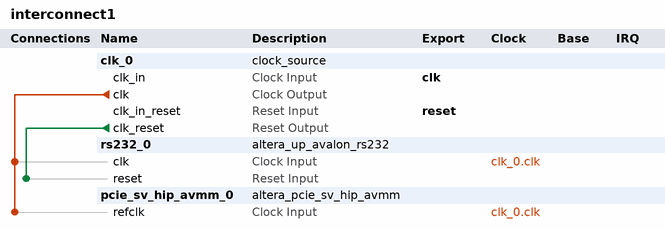
[diagram p0: system contents]
# Platform Designer (Qsys) system interconnect1, Stratix V 5SGXEABN3F45I3YY
# Parameters at their usual value, and those the tool derives, are not listed.
package require -exact qsys 23.1
create_system interconnect1
set_project_property DEVICE_FAMILY {Stratix V}
set_project_property DEVICE 5SGXEABN3F45I3YY

add_instance clk_0 clock_source 23.1
set_instance_parameter_value clk_0 clockFrequency 50000000

add_instance rs232_0 altera_up_avalon_rs232 17.1
set_instance_parameter_value rs232_0 baud 115200
set_instance_parameter_value rs232_0 parity None

add_instance pcie_sv_hip_avmm_0 altera_pcie_sv_hip_avmm 23.1
set_instance_parameter_value pcie_sv_hip_avmm_0 AST_LITE 0
set_instance_parameter_value pcie_sv_hip_avmm_0 AVALON_ADDR_WIDTH 32
set_instance_parameter_value pcie_sv_hip_avmm_0 AddressPage "0\\,1\\,2\\,3\\,4\\,5\\,6\\,7\\,8\\,9\\,10\\,11\\,12\\,13\\,14\\,15"
set_instance_parameter_value pcie_sv_hip_avmm_0 BYPASSS_A2P_TRANSLATION 0
set_instance_parameter_value pcie_sv_hip_avmm_0 CB_A2P_ADDR_MAP_FIXED_TABLE_0_HIGH 0
set_instance_parameter_value pcie_sv_hip_avmm_0 CB_A2P_ADDR_MAP_FIXED_TABLE_0_LOW 0
set_instance_parameter_value pcie_sv_hip_avmm_0 CB_A2P_ADDR_MAP_FIXED_TABLE_10_HIGH 0
set_instance_parameter_value pcie_sv_hip_avmm_0 CB_A2P_ADDR_MAP_FIXED_TABLE_10_LOW 0
set_instance_parameter_value pcie_sv_hip_avmm_0 CB_A2P_ADDR_MAP_FIXED_TABLE_11_HIGH 0
set_instance_parameter_value pcie_sv_hip_avmm_0 CB_A2P_ADDR_MAP_FIXED_TABLE_11_LOW 0
set_instance_parameter_value pcie_sv_hip_avmm_0 CB_A2P_ADDR_MAP_FIXED_TABLE_12_HIGH 0
set_instance_parameter_value pcie_sv_hip_avmm_0 CB_A2P_ADDR_MAP_FIXED_TABLE_12_LOW 0
set_instance_parameter_value pcie_sv_hip_avmm_0 CB_A2P_ADDR_MAP_FIXED_TABLE_13_HIGH 0
set_instance_parameter_value pcie_sv_hip_avmm_0 CB_A2P_ADDR_MAP_FIXED_TABLE_13_LOW 0
set_instance_parameter_value pcie_sv_hip_avmm_0 CB_A2P_ADDR_MAP_FIXED_TABLE_14_HIGH 0
set_instance_parameter_value pcie_sv_hip_avmm_0 CB_A2P_ADDR_MAP_FIXED_TABLE_14_LOW 0
set_instance_parameter_value pcie_sv_hip_avmm_0 CB_A2P_ADDR_MAP_FIXED_TABLE_15_HIGH 0
set_instance_parameter_value pcie_sv_hip_avmm_0 CB_A2P_ADDR_MAP_FIXED_TABLE_15_LOW 0
set_instance_parameter_value pcie_sv_hip_avmm_0 CB_A2P_ADDR_MAP_FIXED_TABLE_1_HIGH 0
set_instance_parameter_value pcie_sv_hip_avmm_0 CB_A2P_ADDR_MAP_FIXED_TABLE_1_LOW 0
set_instance_parameter_value pcie_sv_hip_avmm_0 CB_A2P_ADDR_MAP_FIXED_TABLE_2_HIGH 0
set_instance_parameter_value pcie_sv_hip_avmm_0 CB_A2P_ADDR_MAP_FIXED_TABLE_2_LOW 0
set_instance_parameter_value pcie_sv_hip_avmm_0 CB_A2P_ADDR_MAP_FIXED_TABLE_3_HIGH 0
set_instance_parameter_value pcie_sv_hip_avmm_0 CB_A2P_ADDR_MAP_FIXED_TABLE_3_LOW 0
set_instance_parameter_value pcie_sv_hip_avmm_0 CB_A2P_ADDR_MAP_FIXED_TABLE_4_HIGH 0
set_instance_parameter_value pcie_sv_hip_avmm_0 CB_A2P_ADDR_MAP_FIXED_TABLE_4_LOW 0
set_instance_parameter_value pcie_sv_hip_avmm_0 CB_A2P_ADDR_MAP_FIXED_TABLE_5_HIGH 0
set_instance_parameter_value pcie_sv_hip_avmm_0 CB_A2P_ADDR_MAP_FIXED_TABLE_5_LOW 0
set_instance_parameter_value pcie_sv_hip_avmm_0 CB_A2P_ADDR_MAP_FIXED_TABLE_6_HIGH 0
set_instance_parameter_value pcie_sv_hip_avmm_0 CB_A2P_ADDR_MAP_FIXED_TABLE_6_LOW 0
set_instance_parameter_value pcie_sv_hip_avmm_0 CB_A2P_ADDR_MAP_FIXED_TABLE_7_HIGH 0
set_instance_parameter_value pcie_sv_hip_avmm_0 CB_A2P_ADDR_MAP_FIXED_TABLE_7_LOW 0
set_instance_parameter_value pcie_sv_hip_avmm_0 CB_A2P_ADDR_MAP_FIXED_TABLE_8_HIGH 0
set_instance_parameter_value pcie_sv_hip_avmm_0 CB_A2P_ADDR_MAP_FIXED_TABLE_8_LOW 0
set_instance_parameter_value pcie_sv_hip_avmm_0 CB_A2P_ADDR_MAP_FIXED_TABLE_9_HIGH 0
set_instance_parameter_value pcie_sv_hip_avmm_0 CB_A2P_ADDR_MAP_FIXED_TABLE_9_LOW 0
set_instance_parameter_value pcie_sv_hip_avmm_0 CB_A2P_ADDR_MAP_IS_FIXED 0
set_instance_parameter_value pcie_sv_hip_avmm_0 CB_A2P_ADDR_MAP_NUM_ENTRIES 2
set_instance_parameter_value pcie_sv_hip_avmm_0 CB_A2P_ADDR_MAP_PASS_THRU_BITS 20
set_instance_parameter_value pcie_sv_hip_avmm_0 CB_P2A_AVALON_ADDR_B0 0x00000000
set_instance_parameter_value pcie_sv_hip_avmm_0 CB_P2A_AVALON_ADDR_B1 0x00000000
set_instance_parameter_value pcie_sv_hip_avmm_0 CB_P2A_AVALON_ADDR_B2 0x00000000
set_instance_parameter_value pcie_sv_hip_avmm_0 CB_P2A_AVALON_ADDR_B3 0x00000000
set_instance_parameter_value pcie_sv_hip_avmm_0 CB_P2A_AVALON_ADDR_B4 0x00000000
set_instance_parameter_value pcie_sv_hip_avmm_0 CB_P2A_AVALON_ADDR_B5 0x00000000
set_instance_parameter_value pcie_sv_hip_avmm_0 CB_P2A_FIXED_AVALON_ADDR_B0 0
set_instance_parameter_value pcie_sv_hip_avmm_0 CB_P2A_FIXED_AVALON_ADDR_B1 0
set_instance_parameter_value pcie_sv_hip_avmm_0 CB_P2A_FIXED_AVALON_ADDR_B2 0
set_instance_parameter_value pcie_sv_hip_avmm_0 CB_P2A_FIXED_AVALON_ADDR_B3 0
set_instance_parameter_value pcie_sv_hip_avmm_0 CB_P2A_FIXED_AVALON_ADDR_B4 0
set_instance_parameter_value pcie_sv_hip_avmm_0 CB_P2A_FIXED_AVALON_ADDR_B5 0
set_instance_parameter_value pcie_sv_hip_avmm_0 CB_PCIE_MODE 0
set_instance_parameter_value pcie_sv_hip_avmm_0 CB_PCIE_RX_LITE 0
set_instance_parameter_value pcie_sv_hip_avmm_0 CB_RP_S_ADDR_WIDTH 32
set_instance_parameter_value pcie_sv_hip_avmm_0 CG_COMMON_CLOCK_MODE 1
set_instance_parameter_value pcie_sv_hip_avmm_0 CG_ENABLE_A2P_INTERRUPT 0
set_instance_parameter_value pcie_sv_hip_avmm_0 CG_ENABLE_ADVANCED_INTERRUPT 0
set_instance_parameter_value pcie_sv_hip_avmm_0 CG_ENABLE_HIP_STATUS 0
set_instance_parameter_value pcie_sv_hip_avmm_0 CG_ENABLE_HIP_STATUS_EXTENSION 0
set_instance_parameter_value pcie_sv_hip_avmm_0 CG_IMPL_CRA_AV_SLAVE_PORT 1
set_instance_parameter_value pcie_sv_hip_avmm_0 CG_RXM_IRQ_NUM 16
set_instance_parameter_value pcie_sv_hip_avmm_0 NUM_PREFETCH_MASTERS 1
set_instance_parameter_value pcie_sv_hip_avmm_0 PCIeAddress31_0 "0x00000000\\,0x00000000\\,0x00000000\\,0x00000000\\,0x00000000\\,0x00000000\\,0x00000000\\,0x00000000\\,0x00000000\\,0x00000000\\,0x00000000\\,0x00000000\\,0x00000000\\,0x00000000\\,0x00000000\\,0x00000000"
set_instance_parameter_value pcie_sv_hip_avmm_0 PCIeAddress63_32 "0x00000000\\,0x00000000\\,0x00000000\\,0x00000000\\,0x00000000\\,0x00000000\\,0x00000000\\,0x00000000\\,0x00000000\\,0x00000000\\,0x00000000\\,0x00000000\\,0x00000000\\,0x00000000\\,0x00000000\\,0x00000000"
set_instance_parameter_value pcie_sv_hip_avmm_0 RXM_BEN_WIDTH 8
set_instance_parameter_value pcie_sv_hip_avmm_0 RXM_DATA_WIDTH 64
set_instance_parameter_value pcie_sv_hip_avmm_0 SLAVE_ADDRESS_MAP_0 0
set_instance_parameter_value pcie_sv_hip_avmm_0 SLAVE_ADDRESS_MAP_1 0
set_instance_parameter_value pcie_sv_hip_avmm_0 SLAVE_ADDRESS_MAP_2 0
set_instance_parameter_value pcie_sv_hip_avmm_0 SLAVE_ADDRESS_MAP_3 0
set_instance_parameter_value pcie_sv_hip_avmm_0 SLAVE_ADDRESS_MAP_4 0
set_instance_parameter_value pcie_sv_hip_avmm_0 SLAVE_ADDRESS_MAP_5 0
set_instance_parameter_value pcie_sv_hip_avmm_0 TX_S_ADDR_WIDTH 32
set_instance_parameter_value pcie_sv_hip_avmm_0 advanced_default_hwtcl_atomic_malformed true
set_instance_parameter_value pcie_sv_hip_avmm_0 advanced_default_hwtcl_atomic_op_completer_32bit false
set_instance_parameter_value pcie_sv_hip_avmm_0 advanced_default_hwtcl_atomic_op_completer_64bit false
set_instance_parameter_value pcie_sv_hip_avmm_0 advanced_default_hwtcl_atomic_op_routing false
set_instance_parameter_value pcie_sv_hip_avmm_0 advanced_default_hwtcl_bridge_port_ssid_support false
set_instance_parameter_value pcie_sv_hip_avmm_0 advanced_default_hwtcl_bridge_port_vga_enable false
set_instance_parameter_value pcie_sv_hip_avmm_0 advanced_default_hwtcl_bypass_cdc false
set_instance_parameter_value pcie_sv_hip_avmm_0 advanced_default_hwtcl_cas_completer_128bit false
set_instance_parameter_value pcie_sv_hip_avmm_0 advanced_default_hwtcl_cdc_dummy_insert_limit 11
set_instance_parameter_value pcie_sv_hip_avmm_0 advanced_default_hwtcl_d0_pme false
set_instance_parameter_value pcie_sv_hip_avmm_0 advanced_default_hwtcl_d1_pme false
set_instance_parameter_value pcie_sv_hip_avmm_0 advanced_default_hwtcl_d1_support false
set_instance_parameter_value pcie_sv_hip_avmm_0 advanced_default_hwtcl_d2_pme false
set_instance_parameter_value pcie_sv_hip_avmm_0 advanced_default_hwtcl_d2_support false
set_instance_parameter_value pcie_sv_hip_avmm_0 advanced_default_hwtcl_d3_cold_pme false
set_instance_parameter_value pcie_sv_hip_avmm_0 advanced_default_hwtcl_d3_hot_pme false
set_instance_parameter_value pcie_sv_hip_avmm_0 advanced_default_hwtcl_data_pack_rx disable
set_instance_parameter_value pcie_sv_hip_avmm_0 advanced_default_hwtcl_deskew_comma com_deskw
set_instance_parameter_value pcie_sv_hip_avmm_0 advanced_default_hwtcl_device_number 0
set_instance_parameter_value pcie_sv_hip_avmm_0 advanced_default_hwtcl_disable_link_x2_support false
set_instance_parameter_value pcie_sv_hip_avmm_0 advanced_default_hwtcl_disable_snoop_packet false
set_instance_parameter_value pcie_sv_hip_avmm_0 advanced_default_hwtcl_ei_delay_powerdown_count 10
set_instance_parameter_value pcie_sv_hip_avmm_0 advanced_default_hwtcl_eie_before_nfts_count 4
set_instance_parameter_value pcie_sv_hip_avmm_0 advanced_default_hwtcl_enable_adapter_half_rate_mode false
set_instance_parameter_value pcie_sv_hip_avmm_0 advanced_default_hwtcl_enable_l1_aspm false
set_instance_parameter_value pcie_sv_hip_avmm_0 advanced_default_hwtcl_enable_rx_buffer_checking false
set_instance_parameter_value pcie_sv_hip_avmm_0 advanced_default_hwtcl_extended_format_field false
set_instance_parameter_value pcie_sv_hip_avmm_0 advanced_default_hwtcl_extended_tag_reset false
set_instance_parameter_value pcie_sv_hip_avmm_0 advanced_default_hwtcl_fc_init_timer 1024
set_instance_parameter_value pcie_sv_hip_avmm_0 advanced_default_hwtcl_flow_control_timeout_count 200
set_instance_parameter_value pcie_sv_hip_avmm_0 advanced_default_hwtcl_flow_control_update_count 30
set_instance_parameter_value pcie_sv_hip_avmm_0 advanced_default_hwtcl_flr_capability false
set_instance_parameter_value pcie_sv_hip_avmm_0 advanced_default_hwtcl_gen2_diffclock_nfts_count 255
set_instance_parameter_value pcie_sv_hip_avmm_0 advanced_default_hwtcl_gen2_sameclock_nfts_count 255
set_instance_parameter_value pcie_sv_hip_avmm_0 advanced_default_hwtcl_hot_plug_support 0
set_instance_parameter_value pcie_sv_hip_avmm_0 advanced_default_hwtcl_interrupt_pin inta
set_instance_parameter_value pcie_sv_hip_avmm_0 advanced_default_hwtcl_l01_entry_latency 31
set_instance_parameter_value pcie_sv_hip_avmm_0 advanced_default_hwtcl_l0_exit_latency_diffclock 6
set_instance_parameter_value pcie_sv_hip_avmm_0 advanced_default_hwtcl_l0_exit_latency_sameclock 6
set_instance_parameter_value pcie_sv_hip_avmm_0 advanced_default_hwtcl_l1_exit_latency_diffclock 0
set_instance_parameter_value pcie_sv_hip_avmm_0 advanced_default_hwtcl_l1_exit_latency_sameclock 0
set_instance_parameter_value pcie_sv_hip_avmm_0 advanced_default_hwtcl_low_priority_vc single_vc
set_instance_parameter_value pcie_sv_hip_avmm_0 advanced_default_hwtcl_ltr_mechanism false
set_instance_parameter_value pcie_sv_hip_avmm_0 advanced_default_hwtcl_ltssm_1ms_timeout disable
set_instance_parameter_value pcie_sv_hip_avmm_0 advanced_default_hwtcl_ltssm_freqlocked_check disable
set_instance_parameter_value pcie_sv_hip_avmm_0 advanced_default_hwtcl_maximum_current 0
set_instance_parameter_value pcie_sv_hip_avmm_0 advanced_default_hwtcl_no_command_completed false
set_instance_parameter_value pcie_sv_hip_avmm_0 advanced_default_hwtcl_no_soft_reset false
set_instance_parameter_value pcie_sv_hip_avmm_0 advanced_default_hwtcl_pclk_out_sel pclk
set_instance_parameter_value pcie_sv_hip_avmm_0 advanced_default_hwtcl_pipex1_debug_sel disable
set_instance_parameter_value pcie_sv_hip_avmm_0 advanced_default_hwtcl_register_pipe_signals false
set_instance_parameter_value pcie_sv_hip_avmm_0 advanced_default_hwtcl_reserved_debug 0
set_instance_parameter_value pcie_sv_hip_avmm_0 advanced_default_hwtcl_retry_buffer_last_active_address 2047
set_instance_parameter_value pcie_sv_hip_avmm_0 advanced_default_hwtcl_rx_l0s_count_idl 0
set_instance_parameter_value pcie_sv_hip_avmm_0 advanced_default_hwtcl_set_l0s 0
set_instance_parameter_value pcie_sv_hip_avmm_0 advanced_default_hwtcl_skp_os_gen3_count 0
set_instance_parameter_value pcie_sv_hip_avmm_0 advanced_default_hwtcl_skp_os_schedule_count 0
set_instance_parameter_value pcie_sv_hip_avmm_0 advanced_default_hwtcl_ssid 0
set_instance_parameter_value pcie_sv_hip_avmm_0 advanced_default_hwtcl_ssvid 0
set_instance_parameter_value pcie_sv_hip_avmm_0 advanced_default_hwtcl_tph_completer false
set_instance_parameter_value pcie_sv_hip_avmm_0 advanced_default_hwtcl_tx_cdc_almost_empty 5
set_instance_parameter_value pcie_sv_hip_avmm_0 advanced_default_hwtcl_vc0_clk_enable true
set_instance_parameter_value pcie_sv_hip_avmm_0 advanced_default_hwtcl_wrong_device_id disable
set_instance_parameter_value pcie_sv_hip_avmm_0 advanced_default_parameter_override 0
set_instance_parameter_value pcie_sv_hip_avmm_0 avmm_width_hwtcl 64
set_instance_parameter_value pcie_sv_hip_avmm_0 bar0_type_hwtcl 2
set_instance_parameter_value pcie_sv_hip_avmm_0 bar1_type_hwtcl 0
set_instance_parameter_value pcie_sv_hip_avmm_0 bar2_type_hwtcl 0
set_instance_parameter_value pcie_sv_hip_avmm_0 bar3_type_hwtcl 0
set_instance_parameter_value pcie_sv_hip_avmm_0 bar4_type_hwtcl 0
set_instance_parameter_value pcie_sv_hip_avmm_0 bar5_type_hwtcl 0
set_instance_parameter_value pcie_sv_hip_avmm_0 bypass_tl false
set_instance_parameter_value pcie_sv_hip_avmm_0 class_code_hwtcl 302
set_instance_parameter_value pcie_sv_hip_avmm_0 completion_timeout_hwtcl ABCD
set_instance_parameter_value pcie_sv_hip_avmm_0 device_id_hwtcl 2657
set_instance_parameter_value pcie_sv_hip_avmm_0 dll_active_report_support_hwtcl 0
set_instance_parameter_value pcie_sv_hip_avmm_0 ecrc_check_capable_hwtcl 0
set_instance_parameter_value pcie_sv_hip_avmm_0 ecrc_gen_capable_hwtcl 0
set_instance_parameter_value pcie_sv_hip_avmm_0 enable_completion_timeout_disable_hwtcl 1
set_instance_parameter_value pcie_sv_hip_avmm_0 enable_function_msix_support_hwtcl 0
set_instance_parameter_value pcie_sv_hip_avmm_0 enable_pcisigtest_hwtcl 0
set_instance_parameter_value pcie_sv_hip_avmm_0 enable_power_on_rst_pulse_hwtcl 0
set_instance_parameter_value pcie_sv_hip_avmm_0 enable_slot_register_hwtcl 0
set_instance_parameter_value pcie_sv_hip_avmm_0 enable_tl_only_sim_hwtcl 0
set_instance_parameter_value pcie_sv_hip_avmm_0 endpoint_l0_latency_hwtcl 0
set_instance_parameter_value pcie_sv_hip_avmm_0 endpoint_l1_latency_hwtcl 0
set_instance_parameter_value pcie_sv_hip_avmm_0 expansion_base_address_register_hwtcl 0
set_instance_parameter_value pcie_sv_hip_avmm_0 extend_tag_field_hwtcl 32
set_instance_parameter_value pcie_sv_hip_avmm_0 fixed_address_mode 0
set_instance_parameter_value pcie_sv_hip_avmm_0 force_hrc 0
set_instance_parameter_value pcie_sv_hip_avmm_0 force_src 0
set_instance_parameter_value pcie_sv_hip_avmm_0 gen123_lane_rate_mode_hwtcl {Gen1 (2.5 Gbps)}
set_instance_parameter_value pcie_sv_hip_avmm_0 gen3_rxfreqlock_counter_hwtcl 0
set_instance_parameter_value pcie_sv_hip_avmm_0 hip_reconfig_hwtcl 0
set_instance_parameter_value pcie_sv_hip_avmm_0 hip_tag_checking_hwtcl 1
set_instance_parameter_value pcie_sv_hip_avmm_0 hwtcl_override_g2_txvod 1
set_instance_parameter_value pcie_sv_hip_avmm_0 in_cvp_mode_hwtcl 0
set_instance_parameter_value pcie_sv_hip_avmm_0 io_window_addr_width_hwtcl 0
set_instance_parameter_value pcie_sv_hip_avmm_0 lane_mask_hwtcl x4
set_instance_parameter_value pcie_sv_hip_avmm_0 max_payload_size_hwtcl 128
set_instance_parameter_value pcie_sv_hip_avmm_0 msi_64bit_addressing_capable_hwtcl true
set_instance_parameter_value pcie_sv_hip_avmm_0 msi_masking_capable_hwtcl false
set_instance_parameter_value pcie_sv_hip_avmm_0 msi_multi_message_capable_hwtcl 4
set_instance_parameter_value pcie_sv_hip_avmm_0 msi_support_hwtcl true
set_instance_parameter_value pcie_sv_hip_avmm_0 msix_pba_bir_hwtcl 0
set_instance_parameter_value pcie_sv_hip_avmm_0 msix_pba_offset_hwtcl 0
set_instance_parameter_value pcie_sv_hip_avmm_0 msix_table_bir_hwtcl 0
set_instance_parameter_value pcie_sv_hip_avmm_0 msix_table_offset_hwtcl 0
set_instance_parameter_value pcie_sv_hip_avmm_0 msix_table_size_hwtcl 0
set_instance_parameter_value pcie_sv_hip_avmm_0 override_rxbuffer_cred_preset 0
set_instance_parameter_value pcie_sv_hip_avmm_0 override_tbpartner_driver_setting_hwtcl 0
set_instance_parameter_value pcie_sv_hip_avmm_0 pcie_inspector_hwtcl 0
set_instance_parameter_value pcie_sv_hip_avmm_0 pcie_qsys 1
set_instance_parameter_value pcie_sv_hip_avmm_0 pll_refclk_freq_hwtcl {100 MHz}
set_instance_parameter_value pcie_sv_hip_avmm_0 port_link_number_hwtcl 1
set_instance_parameter_value pcie_sv_hip_avmm_0 port_type_hwtcl {Native endpoint}
set_instance_parameter_value pcie_sv_hip_avmm_0 prefetchable_mem_window_addr_width_hwtcl 0
set_instance_parameter_value pcie_sv_hip_avmm_0 revision_id_hwtcl 1
set_instance_parameter_value pcie_sv_hip_avmm_0 rpre_emph_a_val_hwtcl 9
set_instance_parameter_value pcie_sv_hip_avmm_0 rpre_emph_b_val_hwtcl 0
set_instance_parameter_value pcie_sv_hip_avmm_0 rpre_emph_c_val_hwtcl 16
set_instance_parameter_value pcie_sv_hip_avmm_0 rpre_emph_d_val_hwtcl 13
set_instance_parameter_value pcie_sv_hip_avmm_0 rpre_emph_e_val_hwtcl 5
set_instance_parameter_value pcie_sv_hip_avmm_0 rvod_sel_a_val_hwtcl 42
set_instance_parameter_value pcie_sv_hip_avmm_0 rvod_sel_b_val_hwtcl 38
set_instance_parameter_value pcie_sv_hip_avmm_0 rvod_sel_c_val_hwtcl 38
set_instance_parameter_value pcie_sv_hip_avmm_0 rvod_sel_d_val_hwtcl 43
set_instance_parameter_value pcie_sv_hip_avmm_0 rvod_sel_e_val_hwtcl 15
set_instance_parameter_value pcie_sv_hip_avmm_0 rxbuffer_rxreq_hwtcl Low
set_instance_parameter_value pcie_sv_hip_avmm_0 serial_sim_hwtcl 1
set_instance_parameter_value pcie_sv_hip_avmm_0 set_pld_clk_x1_625MHz_hwtcl 0
set_instance_parameter_value pcie_sv_hip_avmm_0 slot_number_hwtcl 0
set_instance_parameter_value pcie_sv_hip_avmm_0 slot_power_limit_hwtcl 0
set_instance_parameter_value pcie_sv_hip_avmm_0 slot_power_scale_hwtcl 0
set_instance_parameter_value pcie_sv_hip_avmm_0 slotclkcfg_hwtcl 1
set_instance_parameter_value pcie_sv_hip_avmm_0 subsystem_device_id_hwtcl 177
set_instance_parameter_value pcie_sv_hip_avmm_0 subsystem_vendor_id_hwtcl 97
set_instance_parameter_value pcie_sv_hip_avmm_0 surprise_down_error_support_hwtcl 0
set_instance_parameter_value pcie_sv_hip_avmm_0 tlp_insp_trg_dw0_hwtcl 2049
set_instance_parameter_value pcie_sv_hip_avmm_0 tlp_insp_trg_dw1_hwtcl 0
set_instance_parameter_value pcie_sv_hip_avmm_0 tlp_insp_trg_dw2_hwtcl 0
set_instance_parameter_value pcie_sv_hip_avmm_0 tlp_insp_trg_dw3_hwtcl 0
set_instance_parameter_value pcie_sv_hip_avmm_0 tlp_inspector_hwtcl 0
set_instance_parameter_value pcie_sv_hip_avmm_0 tlp_inspector_use_signal_probe_hwtcl 0
set_instance_parameter_value pcie_sv_hip_avmm_0 use_aer_hwtcl 0
set_instance_parameter_value pcie_sv_hip_avmm_0 use_ast_parity 0
set_instance_parameter_value pcie_sv_hip_avmm_0 use_atx_pll_hwtcl 0
set_instance_parameter_value pcie_sv_hip_avmm_0 use_crc_forwarding_hwtcl 0
set_instance_parameter_value pcie_sv_hip_avmm_0 use_cvp_update_core_pof_hwtcl 0
set_instance_parameter_value pcie_sv_hip_avmm_0 use_rx_st_be_hwtcl 0
set_instance_parameter_value pcie_sv_hip_avmm_0 user_id_hwtcl 0
set_instance_parameter_value pcie_sv_hip_avmm_0 vendor_id_hwtcl 6826
set_instance_parameter_value pcie_sv_hip_avmm_0 vsec_id_hwtcl 4466
set_instance_parameter_value pcie_sv_hip_avmm_0 vsec_rev_hwtcl 0

# connections
add_connection clk_0.clk pcie_sv_hip_avmm_0.refclk clock
add_connection clk_0.clk rs232_0.clk clock
add_connection clk_0.clk_reset rs232_0.reset reset

# exported interfaces
add_interface clk clock sink
set_interface_property clk EXPORT_OF clk_0.clk_in
add_interface reset reset sink
set_interface_property reset EXPORT_OF clk_0.clk_in_reset

set_interconnect_requirement {$system} qsys_mm.clockCrossingAdapter HANDSHAKE
set_interconnect_requirement {$system} qsys_mm.enableEccProtection FALSE
set_interconnect_requirement {$system} qsys_mm.insertDefaultSlave FALSE
set_interconnect_requirement {$system} qsys_mm.maxAdditionalLatency 1

save_system interconnect1.qsys
